# Altium schematic sheet HashUnit4.SchDoc: ANT_Miner_V1.3
size A2; Date: 2013/11/20; DrawnBy: Bitmain Technology; SheetNumber: 9; SheetTotal: 9
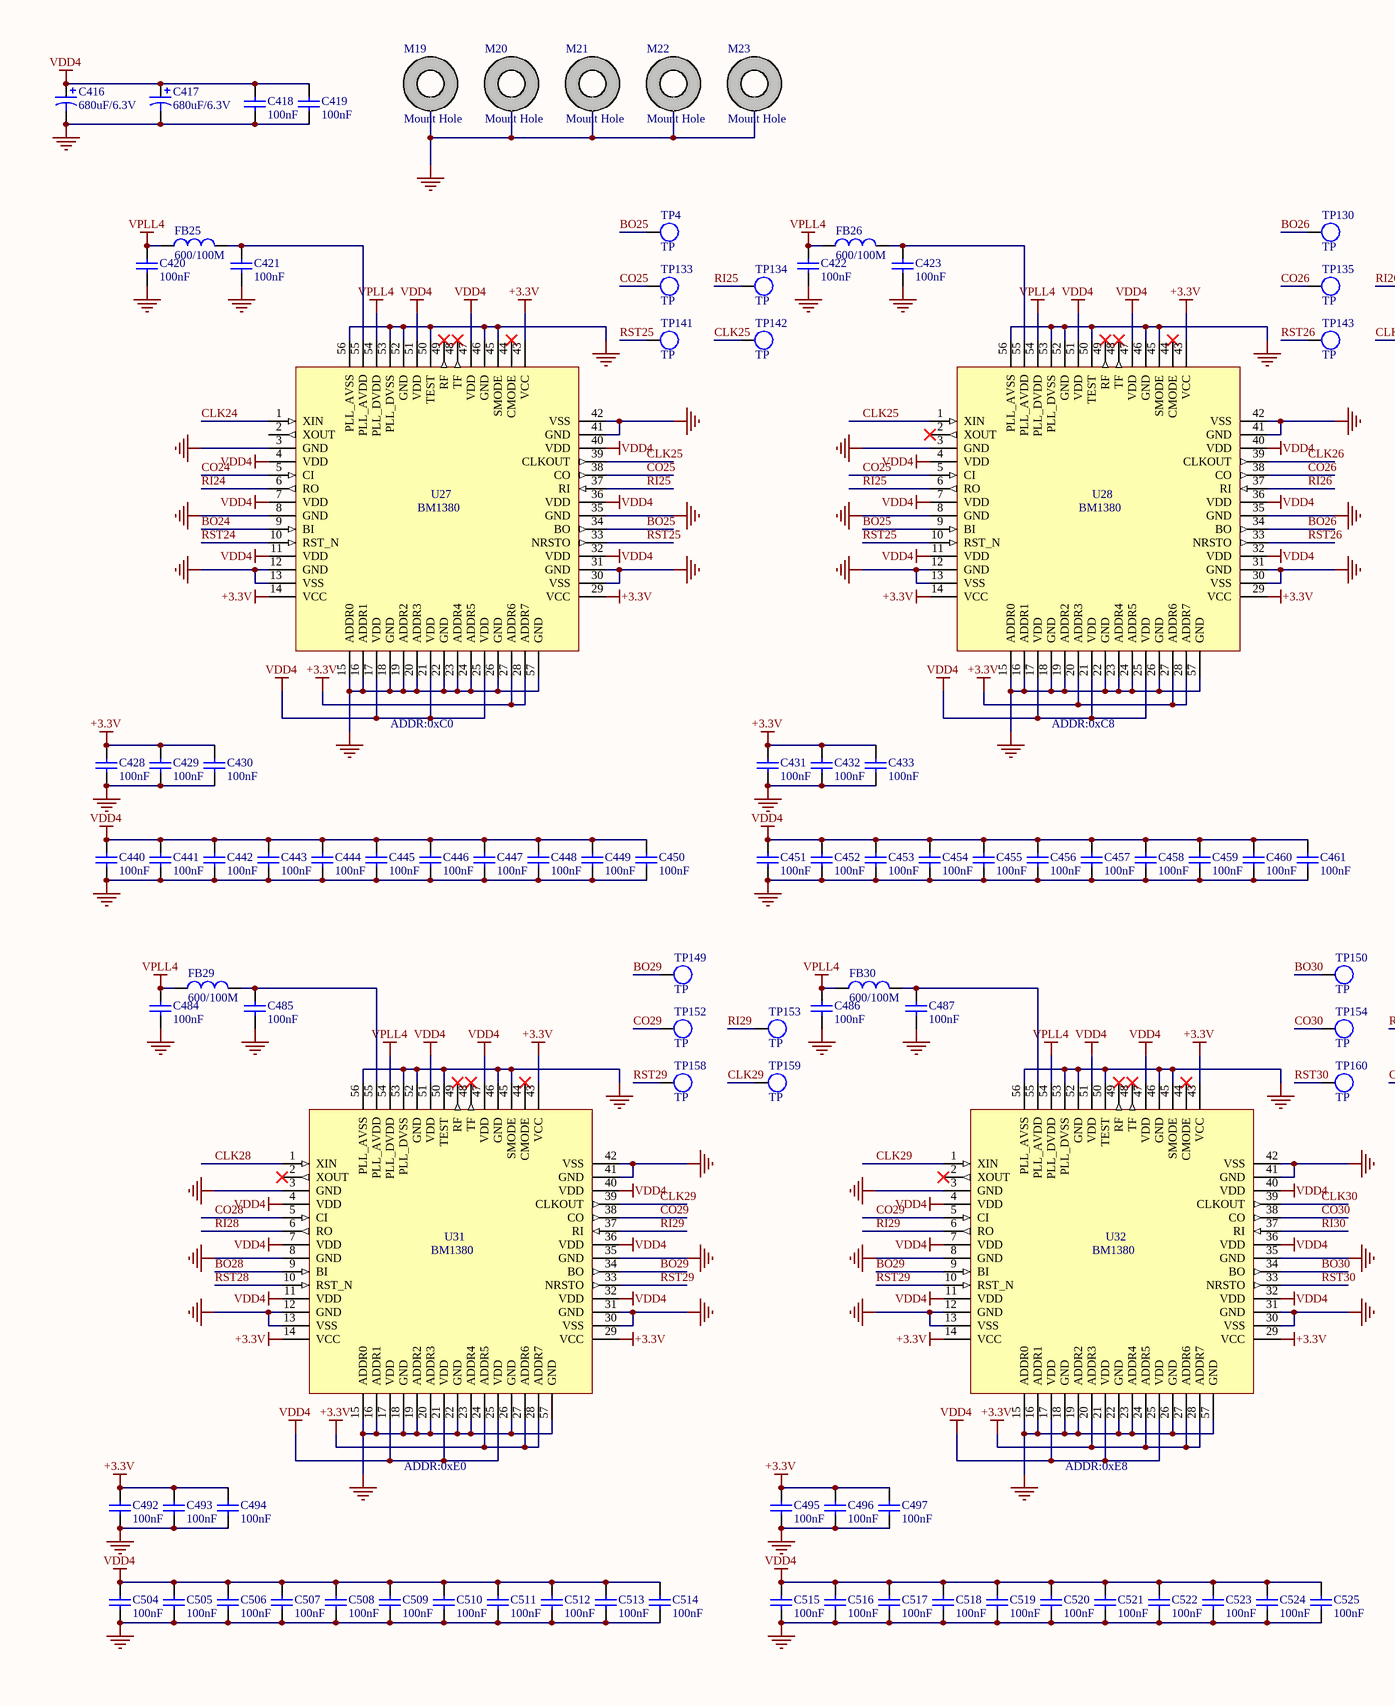
[diagram p0: HashUnit4.SchDoc, left]
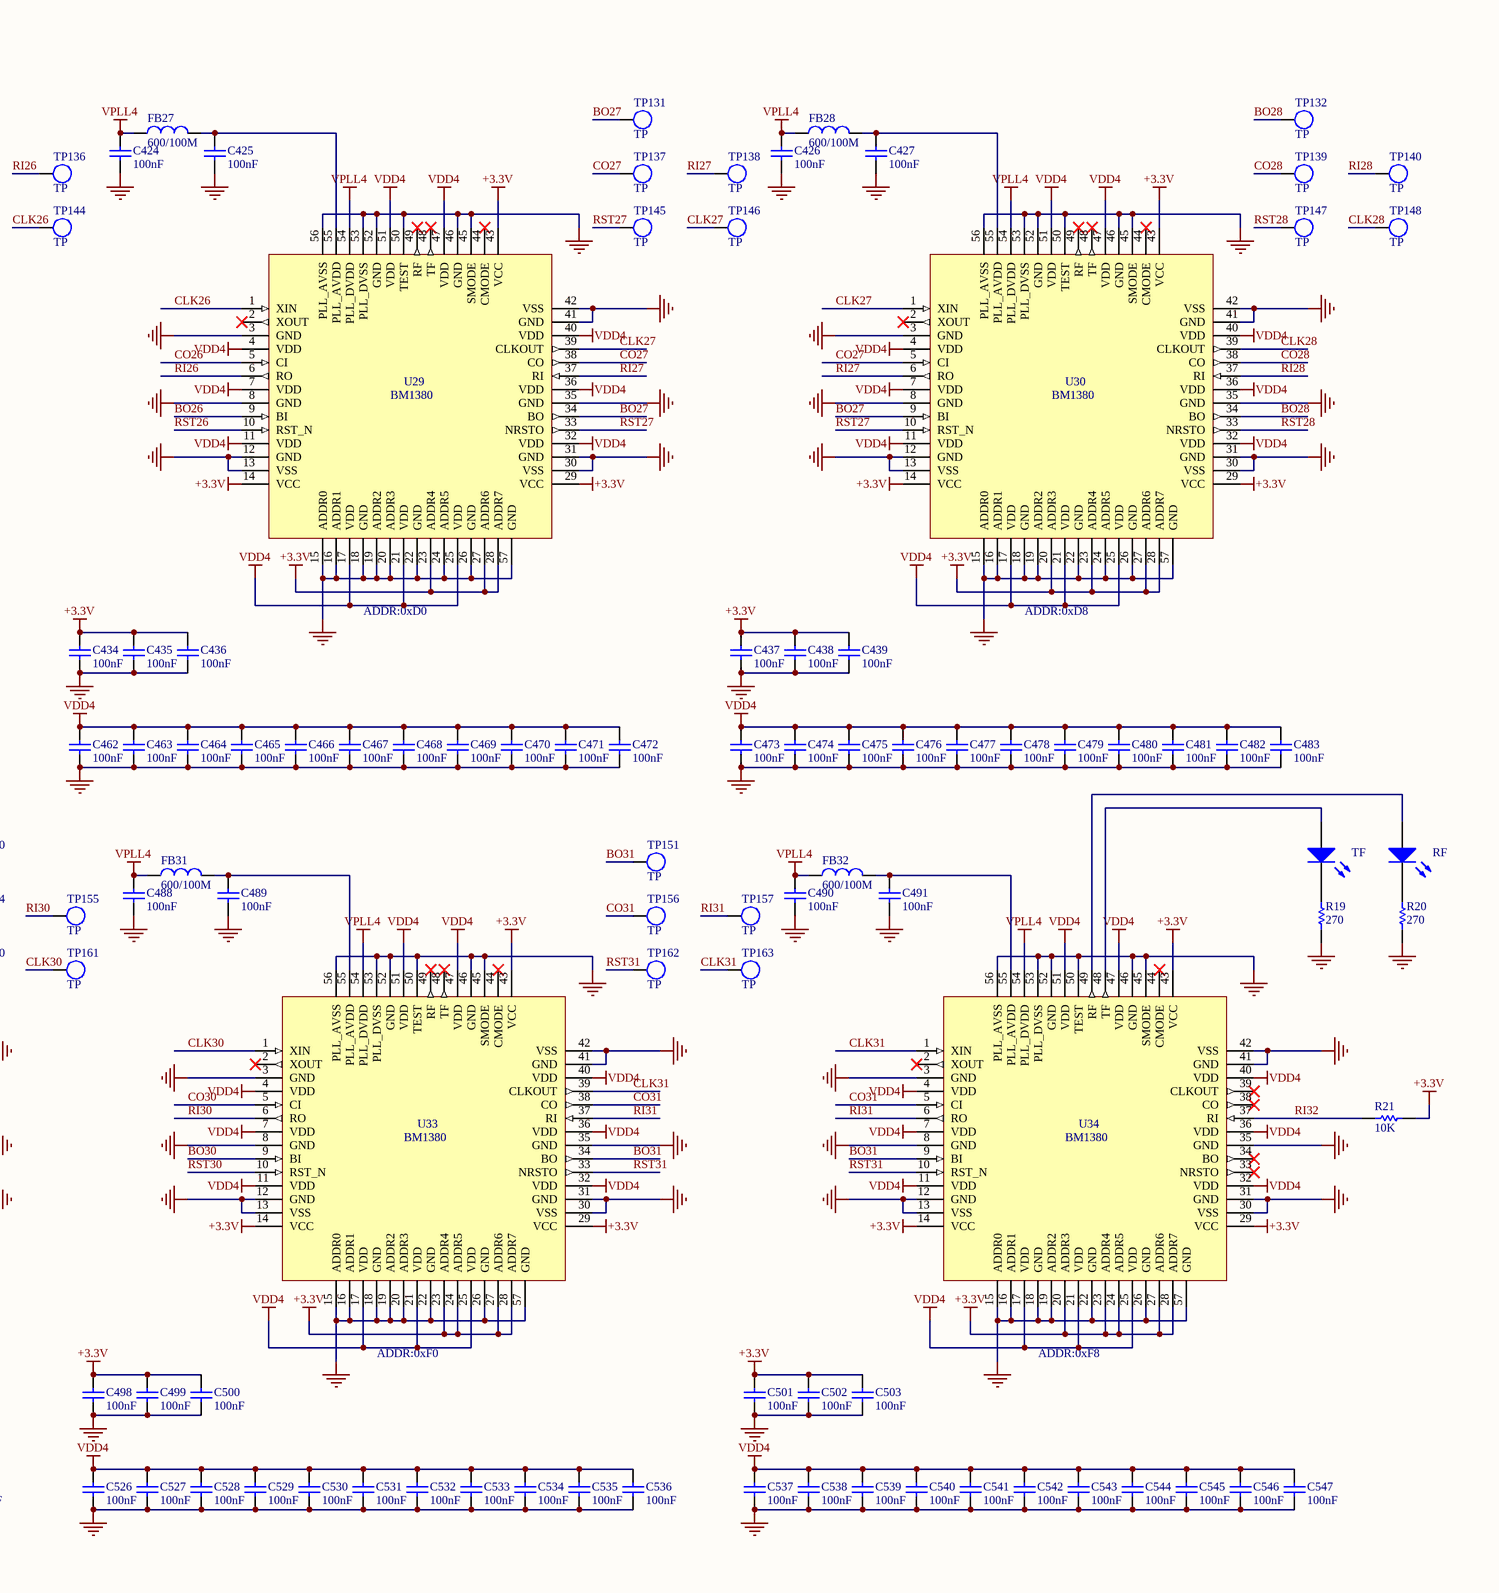
[diagram p1: HashUnit4.SchDoc, right]

## Parts
C416  680uF/6.3V  [D]
C417  680uF/6.3V  [D]
C418  100nF  [CC0603(1608)]
C419  100nF  [CC0603(1608)]
C420  100nF  [CC0603(1608)]
C421  100nF  [CC0603(1608)]
C422  100nF  [CC0603(1608)]
C423  100nF  [CC0603(1608)]
C424  100nF  [CC0603(1608)]
C425  100nF  [CC0603(1608)]
C426  100nF  [CC0603(1608)]
C427  100nF  [CC0603(1608)]
C428  100nF  [CC0603(1608)]
C429  100nF  [CC0603(1608)]
C430  100nF  [CC0603(1608)]
C431  100nF  [CC0603(1608)]
C432  100nF  [CC0603(1608)]
C433  100nF  [CC0603(1608)]
C434  100nF  [CC0603(1608)]
C435  100nF  [CC0603(1608)]
C436  100nF  [CC0603(1608)]
C437  100nF  [CC0603(1608)]
C438  100nF  [CC0603(1608)]
C439  100nF  [CC0603(1608)]
C440  100nF  [CC0603(1608)]
C441  100nF  [CC0603(1608)]
C442  100nF  [CC0603(1608)]
C443  100nF  [CC0603(1608)]
C444  100nF  [CC0603(1608)]
C445  100nF  [CC0603(1608)]
C446  100nF  [CC0603(1608)]
C447  100nF  [CC0603(1608)]
C448  100nF  [CC0603(1608)]
C449  100nF  [CC0603(1608)]
C450  100nF  [CC0603(1608)]
C451  100nF  [CC0603(1608)]
C452  100nF  [CC0603(1608)]
C453  100nF  [CC0603(1608)]
C454  100nF  [CC0603(1608)]
C455  100nF  [CC0603(1608)]
C456  100nF  [CC0603(1608)]
C457  100nF  [CC0603(1608)]
C458  100nF  [CC0603(1608)]
C459  100nF  [CC0603(1608)]
C460  100nF  [CC0603(1608)]
C461  100nF  [CC0603(1608)]
C462  100nF  [CC0603(1608)]
C463  100nF  [CC0603(1608)]
C464  100nF  [CC0603(1608)]
C465  100nF  [CC0603(1608)]
C466  100nF  [CC0603(1608)]
C467  100nF  [CC0603(1608)]
C468  100nF  [CC0603(1608)]
C469  100nF  [CC0603(1608)]
C470  100nF  [CC0603(1608)]
C471  100nF  [CC0603(1608)]
C472  100nF  [CC0603(1608)]
C473  100nF  [CC0603(1608)]
C474  100nF  [CC0603(1608)]
C475  100nF  [CC0603(1608)]
C476  100nF  [CC0603(1608)]
C477  100nF  [CC0603(1608)]
C478  100nF  [CC0603(1608)]
C479  100nF  [CC0603(1608)]
C480  100nF  [CC0603(1608)]
C481  100nF  [CC0603(1608)]
C482  100nF  [CC0603(1608)]
C483  100nF  [CC0603(1608)]
C484  100nF  [CC0603(1608)]
C485  100nF  [CC0603(1608)]
C486  100nF  [CC0603(1608)]
C487  100nF  [CC0603(1608)]
C488  100nF  [CC0603(1608)]
C489  100nF  [CC0603(1608)]
C490  100nF  [CC0603(1608)]
C491  100nF  [CC0603(1608)]
C492  100nF  [CC0603(1608)]
C493  100nF  [CC0603(1608)]
C494  100nF  [CC0603(1608)]
C495  100nF  [CC0603(1608)]
C496  100nF  [CC0603(1608)]
C497  100nF  [CC0603(1608)]
C498  100nF  [CC0603(1608)]
C499  100nF  [CC0603(1608)]
C500  100nF  [CC0603(1608)]
C501  100nF  [CC0603(1608)]
C502  100nF  [CC0603(1608)]
C503  100nF  [CC0603(1608)]
C504  100nF  [CC0603(1608)]
C505  100nF  [CC0603(1608)]
C506  100nF  [CC0603(1608)]
C507  100nF  [CC0603(1608)]
C508  100nF  [CC0603(1608)]
C509  100nF  [CC0603(1608)]
C510  100nF  [CC0603(1608)]
C511  100nF  [CC0603(1608)]
C512  100nF  [CC0603(1608)]
C513  100nF  [CC0603(1608)]
C514  100nF  [CC0603(1608)]
C515  100nF  [CC0603(1608)]
C516  100nF  [CC0603(1608)]
C517  100nF  [CC0603(1608)]
C518  100nF  [CC0603(1608)]
C519  100nF  [CC0603(1608)]
C520  100nF  [CC0603(1608)]
C521  100nF  [CC0603(1608)]
C522  100nF  [CC0603(1608)]
C523  100nF  [CC0603(1608)]
C524  100nF  [CC0603(1608)]
C525  100nF  [CC0603(1608)]
C526  100nF  [CC0603(1608)]
C527  100nF  [CC0603(1608)]
C528  100nF  [CC0603(1608)]
C529  100nF  [CC0603(1608)]
C530  100nF  [CC0603(1608)]
C531  100nF  [CC0603(1608)]
C532  100nF  [CC0603(1608)]
C533  100nF  [CC0603(1608)]
C534  100nF  [CC0603(1608)]
C535  100nF  [CC0603(1608)]
C536  100nF  [CC0603(1608)]
C537  100nF  [CC0603(1608)]
C538  100nF  [CC0603(1608)]
C539  100nF  [CC0603(1608)]
C540  100nF  [CC0603(1608)]
C541  100nF  [CC0603(1608)]
C542  100nF  [CC0603(1608)]
C543  100nF  [CC0603(1608)]
C544  100nF  [CC0603(1608)]
C545  100nF  [CC0603(1608)]
C546  100nF  [CC0603(1608)]
C547  100nF  [CC0603(1608)]
FB25  600/100M  [FB0603(1608)]
FB26  600/100M  [FB0603(1608)]
FB27  600/100M  [FB0603(1608)]
FB28  600/100M  [FB0603(1608)]
FB29  600/100M  [FB0603(1608)]
FB30  600/100M  [FB0603(1608)]
FB31  600/100M  [FB0603(1608)]
FB32  600/100M  [FB0603(1608)]
M19  Mount Hole  [MHOLE2]
M20  Mount Hole  [MHOLE2]
M21  Mount Hole  [MHOLE2]
M22  Mount Hole  [MHOLE2]
M23  Mount Hole  [MHOLE2]
R19  270  [RR0603(1608)]
R20  270  [RR0603(1608)]
R21  10K  [RR0603(1608)]
RF  Green  [LED0603(1608)]  (value not drawn)
TF  Green  [LED0603(1608)]  (value not drawn)
TP4  TP  [TP_SMD]
TP130  TP  [TP_SMD]
TP131  TP  [TP_SMD]
TP132  TP  [TP_SMD]
TP133  TP  [TP_SMD]
TP134  TP  [TP_SMD]
TP135  TP  [TP_SMD]
TP136  TP  [TP_SMD]
TP137  TP  [TP_SMD]
TP138  TP  [TP_SMD]
TP139  TP  [TP_SMD]
TP140  TP  [TP_SMD]
TP141  TP  [TP_SMD]
TP142  TP  [TP_SMD]
TP143  TP  [TP_SMD]
TP144  TP  [TP_SMD]
TP145  TP  [TP_SMD]
TP146  TP  [TP_SMD]
TP147  TP  [TP_SMD]
TP148  TP  [TP_SMD]
TP149  TP  [TP_SMD]
TP150  TP  [TP_SMD]
TP151  TP  [TP_SMD]
TP152  TP  [TP_SMD]
TP153  TP  [TP_SMD]
TP154  TP  [TP_SMD]
TP155  TP  [TP_SMD]
TP156  TP  [TP_SMD]
TP157  TP  [TP_SMD]
TP158  TP  [TP_SMD]
TP159  TP  [TP_SMD]
TP160  TP  [TP_SMD]
TP161  TP  [TP_SMD]
TP162  TP  [TP_SMD]
TP163  TP  [TP_SMD]
U27  BM1380  [QFN56]
U28  BM1380  [QFN56]
U29  BM1380  [QFN56]
U30  BM1380  [QFN56]
U31  BM1380  [QFN56]
U32  BM1380  [QFN56]
U33  BM1380  [QFN56]
U34  BM1380  [QFN56]

## Nets
+3.3V: C428.2 C429.2 C430.2 C431.2 C432.2 C433.2 C434.2 C435.2 C436.2 C437.2 C438.2 C439.2 C492.2 C493.2 C494.2 C495.2 C496.2 C497.2 C498.2 C499.2 C500.2 C501.2 C502.2 C503.2 R21.2 U27.14(VCC) U27.27(ADDR6) U27.28(ADDR7) U27.29(VCC) U27.43(VCC) U28.14(VCC) U28.20(ADDR3) U28.27(ADDR6) U28.28(ADDR7) U28.29(VCC) U28.43(VCC) U29.14(VCC) U29.23(ADDR4) U29.27(ADDR6) U29.28(ADDR7) U29.29(VCC) U29.43(VCC) U30.14(VCC) U30.20(ADDR3) U30.23(ADDR4) U30.27(ADDR6) U30.28(ADDR7) U30.29(VCC) U30.43(VCC) U31.14(VCC) U31.24(ADDR5) U31.27(ADDR6) U31.28(ADDR7) U31.29(VCC) U31.43(VCC) U32.14(VCC) U32.20(ADDR3) U32.24(ADDR5) U32.27(ADDR6) U32.28(ADDR7) U32.29(VCC) U32.43(VCC) U33.14(VCC) U33.23(ADDR4) U33.24(ADDR5) U33.27(ADDR6) U33.28(ADDR7) U33.29(VCC) U33.43(VCC) U34.14(VCC) U34.20(ADDR3) U34.23(ADDR4) U34.24(ADDR5) U34.27(ADDR6) U34.28(ADDR7) U34.29(VCC) U34.43(VCC)
GND: C416.2 C417.2 C418.1 C419.1 C420.2 C421.1 C422.2 C423.1 C424.2 C425.1 C426.2 C427.1 C428.1 C429.1 C430.1 C431.1 C432.1 C433.1 C434.1 C435.1 C436.1 C437.1 C438.1 C439.1 C440.1 C441.1 C442.1 C443.1 C444.1 C445.1 C446.1 C447.1 C448.1 C449.1 C450.1 C451.1 C452.1 C453.1 C454.1 C455.1 C456.1 C457.1 C458.1 C459.1 C460.1 C461.1 C462.1 C463.1 C464.1 C465.1 C466.1 C467.1 C468.1 C469.1 C470.1 C471.1 C472.1 C473.1 C474.1 C475.1 C476.1 C477.1 C478.1 C479.1 C480.1 C481.1 C482.1 C483.1 C484.2 C485.1 C486.2 C487.1 C488.2 C489.1 C490.2 C491.1 C492.1 C493.1 C494.1 C495.1 C496.1 C497.1 C498.1 C499.1 C500.1 C501.1 C502.1 C503.1 C504.1 C505.1 C506.1 C507.1 C508.1 C509.1 C510.1 C511.1 C512.1 C513.1 C514.1 C515.1 C516.1 C517.1 C518.1 C519.1 C520.1 C521.1 C522.1 C523.1 C524.1 C525.1 C526.1 C527.1 C528.1 C529.1 C530.1 C531.1 C532.1 C533.1 C534.1 C535.1 C536.1 C537.1 C538.1 C539.1 C540.1 C541.1 C542.1 C543.1 C544.1 C545.1 C546.1 C547.1 M19.0(PIN) M20.0(PIN) M21.0(PIN) M22.0(PIN) M23.0(PIN) R19.1 R20.1 U27.3(GND) U27.8(GND) U27.12(GND) U27.13(VSS) U27.15(ADDR0) U27.16(ADDR1) U27.18(GND) U27.19(ADDR2) U27.20(ADDR3) U27.22(GND) U27.23(ADDR4) U27.24(ADDR5) U27.26(GND) U27.30(VSS) U27.31(GND) U27.35(GND) U27.41(GND) U27.42(VSS) U27.45(SMODE) U27.46(GND) U27.50(TEST) U27.52(GND) U27.53(PLL_DVSS) U27.56(PLL_AVSS) U27.57(GND) U28.3(GND) U28.8(GND) U28.12(GND) U28.13(VSS) U28.15(ADDR0) U28.16(ADDR1) U28.18(GND) U28.19(ADDR2) U28.22(GND) U28.23(ADDR4) U28.24(ADDR5) U28.26(GND) U28.30(VSS) U28.31(GND) U28.35(GND) U28.41(GND) U28.42(VSS) U28.45(SMODE) U28.46(GND) U28.50(TEST) U28.52(GND) U28.53(PLL_DVSS) U28.56(PLL_AVSS) U28.57(GND) U29.3(GND) U29.8(GND) U29.12(GND) U29.13(VSS) U29.15(ADDR0) U29.16(ADDR1) U29.18(GND) U29.19(ADDR2) U29.20(ADDR3) U29.22(GND) U29.24(ADDR5) U29.26(GND) U29.30(VSS) U29.31(GND) U29.35(GND) U29.41(GND) U29.42(VSS) U29.45(SMODE) U29.46(GND) U29.50(TEST) U29.52(GND) U29.53(PLL_DVSS) U29.56(PLL_AVSS) U29.57(GND) U30.3(GND) U30.8(GND) U30.12(GND) U30.13(VSS) U30.15(ADDR0) U30.16(ADDR1) U30.18(GND) U30.19(ADDR2) U30.22(GND) U30.24(ADDR5) U30.26(GND) U30.30(VSS) U30.31(GND) U30.35(GND) U30.41(GND) U30.42(VSS) U30.45(SMODE) U30.46(GND) U30.50(TEST) U30.52(GND) U30.53(PLL_DVSS) U30.56(PLL_AVSS) U30.57(GND) U31.3(GND) U31.8(GND) U31.12(GND) U31.13(VSS) U31.15(ADDR0) U31.16(ADDR1) U31.18(GND) U31.19(ADDR2) U31.20(ADDR3) U31.22(GND) U31.23(ADDR4) U31.26(GND) U31.30(VSS) U31.31(GND) U31.35(GND) U31.41(GND) U31.42(VSS) U31.45(SMODE) U31.46(GND) U31.50(TEST) U31.52(GND) U31.53(PLL_DVSS) U31.56(PLL_AVSS) U31.57(GND) U32.3(GND) U32.8(GND) U32.12(GND) U32.13(VSS) U32.15(ADDR0) U32.16(ADDR1) U32.18(GND) U32.19(ADDR2) U32.22(GND) U32.23(ADDR4) U32.26(GND) U32.30(VSS) U32.31(GND) U32.35(GND) U32.41(GND) U32.42(VSS) U32.45(SMODE) U32.46(GND) U32.50(TEST) U32.52(GND) U32.53(PLL_DVSS) U32.56(PLL_AVSS) U32.57(GND) U33.3(GND) U33.8(GND) U33.12(GND) U33.13(VSS) U33.15(ADDR0) U33.16(ADDR1) U33.18(GND) U33.19(ADDR2) U33.20(ADDR3) U33.22(GND) U33.26(GND) U33.30(VSS) U33.31(GND) U33.35(GND) U33.41(GND) U33.42(VSS) U33.45(SMODE) U33.46(GND) U33.50(TEST) U33.52(GND) U33.53(PLL_DVSS) U33.56(PLL_AVSS) U33.57(GND) U34.3(GND) U34.8(GND) U34.12(GND) U34.13(VSS) U34.15(ADDR0) U34.16(ADDR1) U34.18(GND) U34.19(ADDR2) U34.22(GND) U34.26(GND) U34.30(VSS) U34.31(GND) U34.35(GND) U34.41(GND) U34.42(VSS) U34.45(SMODE) U34.46(GND) U34.50(TEST) U34.52(GND) U34.53(PLL_DVSS) U34.56(PLL_AVSS) U34.57(GND)
VDD4: C416.1 C417.1 C418.2 C419.2 C440.2 C441.2 C442.2 C443.2 C444.2 C445.2 C446.2 C447.2 C448.2 C449.2 C450.2 C451.2 C452.2 C453.2 C454.2 C455.2 C456.2 C457.2 C458.2 C459.2 C460.2 C461.2 C462.2 C463.2 C464.2 C465.2 C466.2 C467.2 C468.2 C469.2 C470.2 C471.2 C472.2 C473.2 C474.2 C475.2 C476.2 C477.2 C478.2 C479.2 C480.2 C481.2 C482.2 C483.2 C504.2 C505.2 C506.2 C507.2 C508.2 C509.2 C510.2 C511.2 C512.2 C513.2 C514.2 C515.2 C516.2 C517.2 C518.2 C519.2 C520.2 C521.2 C522.2 C523.2 C524.2 C525.2 C526.2 C527.2 C528.2 C529.2 C530.2 C531.2 C532.2 C533.2 C534.2 C535.2 C536.2 C537.2 C538.2 C539.2 C540.2 C541.2 C542.2 C543.2 C544.2 C545.2 C546.2 C547.2 U27.4(VDD) U27.7(VDD) U27.11(VDD) U27.17(VDD) U27.21(VDD) U27.25(VDD) U27.32(VDD) U27.36(VDD) U27.40(VDD) U27.47(VDD) U27.51(VDD) U28.4(VDD) U28.7(VDD) U28.11(VDD) U28.17(VDD) U28.21(VDD) U28.25(VDD) U28.32(VDD) U28.36(VDD) U28.40(VDD) U28.47(VDD) U28.51(VDD) U29.4(VDD) U29.7(VDD) U29.11(VDD) U29.17(VDD) U29.21(VDD) U29.25(VDD) U29.32(VDD) U29.36(VDD) U29.40(VDD) U29.47(VDD) U29.51(VDD) U30.4(VDD) U30.7(VDD) U30.11(VDD) U30.17(VDD) U30.21(VDD) U30.25(VDD) U30.32(VDD) U30.36(VDD) U30.40(VDD) U30.47(VDD) U30.51(VDD) U31.4(VDD) U31.7(VDD) U31.11(VDD) U31.17(VDD) U31.21(VDD) U31.25(VDD) U31.32(VDD) U31.36(VDD) U31.40(VDD) U31.47(VDD) U31.51(VDD) U32.4(VDD) U32.7(VDD) U32.11(VDD) U32.17(VDD) U32.21(VDD) U32.25(VDD) U32.32(VDD) U32.36(VDD) U32.40(VDD) U32.47(VDD) U32.51(VDD) U33.4(VDD) U33.7(VDD) U33.11(VDD) U33.17(VDD) U33.21(VDD) U33.25(VDD) U33.32(VDD) U33.36(VDD) U33.40(VDD) U33.47(VDD) U33.51(VDD) U34.4(VDD) U34.7(VDD) U34.11(VDD) U34.17(VDD) U34.21(VDD) U34.25(VDD) U34.32(VDD) U34.36(VDD) U34.40(VDD) U34.47(VDD) U34.51(VDD)
VPLL4: C420.1 C422.1 C424.1 C426.1 C484.1 C486.1 C488.1 C490.1 FB25.2 FB26.2 FB27.2 FB28.2 FB29.2 FB30.2 FB31.2 FB32.2 U27.54(PLL_DVDD) U28.54(PLL_DVDD) U29.54(PLL_DVDD) U30.54(PLL_DVDD) U31.54(PLL_DVDD) U32.54(PLL_DVDD) U33.54(PLL_DVDD) U34.54(PLL_DVDD)
BO24: U27.9(BI)
BO25: TP4.1 U27.34(BO) U28.9(BI)
BO26: TP130.1 U28.34(BO) U29.9(BI)
BO27: TP131.1 U29.34(BO) U30.9(BI)
BO28: TP132.1 U30.34(BO) U31.9(BI)
BO29: TP149.1 U31.34(BO) U32.9(BI)
BO30: TP150.1 U32.34(BO) U33.9(BI)
BO31: TP151.1 U33.34(BO) U34.9(BI)
CLK24: U27.1(XIN)
CLK25: TP142.1 U27.39(CLKOUT) U28.1(XIN)
CLK26: TP144.1 U28.39(CLKOUT) U29.1(XIN)
CLK27: TP146.1 U29.39(CLKOUT) U30.1(XIN)
CLK28: TP148.1 U30.39(CLKOUT) U31.1(XIN)
CLK29: TP159.1 U31.39(CLKOUT) U32.1(XIN)
CLK30: TP161.1 U32.39(CLKOUT) U33.1(XIN)
CLK31: TP163.1 U33.39(CLKOUT) U34.1(XIN)
CO24: U27.5(CI)
CO25: TP133.1 U27.38(CO) U28.5(CI)
CO26: TP135.1 U28.38(CO) U29.5(CI)
CO27: TP137.1 U29.38(CO) U30.5(CI)
CO28: TP139.1 U30.38(CO) U31.5(CI)
CO29: TP152.1 U31.38(CO) U32.5(CI)
CO30: TP154.1 U32.38(CO) U33.5(CI)
CO31: TP156.1 U33.38(CO) U34.5(CI)
RI24: U27.6(RO)
RI25: TP134.1 U27.37(RI) U28.6(RO)
RI26: TP136.1 U28.37(RI) U29.6(RO)
RI27: TP138.1 U29.37(RI) U30.6(RO)
RI28: TP140.1 U30.37(RI) U31.6(RO)
RI29: TP153.1 U31.37(RI) U32.6(RO)
RI30: TP155.1 U32.37(RI) U33.6(RO)
RI31: TP157.1 U33.37(RI) U34.6(RO)
RI32: R21.1 U34.37(RI)
RST24: U27.10(RST_N)
RST25: TP141.1 U27.33(NRSTO) U28.10(RST_N)
RST26: TP143.1 U28.33(NRSTO) U29.10(RST_N)
RST27: TP145.1 U29.33(NRSTO) U30.10(RST_N)
RST28: TP147.1 U30.33(NRSTO) U31.10(RST_N)
RST29: TP158.1 U31.33(NRSTO) U32.10(RST_N)
RST30: TP160.1 U32.33(NRSTO) U33.10(RST_N)
RST31: TP162.1 U33.33(NRSTO) U34.10(RST_N)
NetC421_2: C421.2 FB25.1 U27.55(PLL_AVDD)
NetC423_2: C423.2 FB26.1 U28.55(PLL_AVDD)
NetC425_2: C425.2 FB27.1 U29.55(PLL_AVDD)
NetC427_2: C427.2 FB28.1 U30.55(PLL_AVDD)
NetC485_2: C485.2 FB29.1 U31.55(PLL_AVDD)
NetC487_2: C487.2 FB30.1 U32.55(PLL_AVDD)
NetC489_2: C489.2 FB31.1 U33.55(PLL_AVDD)
NetC491_2: C491.2 FB32.1 U34.55(PLL_AVDD)
NetR19_2: R19.2 TF.2(K)
NetR20_2: R20.2 RF.2(K)
NetRF_1: RF.1(A) U34.49(RF)
NetTF_1: TF.1(A) U34.48(TF)

Not connected (* = marked no-connect by the designer): U27 2(XOUT) 44(CMODE)* 48(TF)* 49(RF)*; U28 2(XOUT)* 44(CMODE)* 48(TF)* 49(RF)*; U29 2(XOUT)* 44(CMODE)* 48(TF)* 49(RF)*; U30 2(XOUT)* 44(CMODE)* 48(TF)* 49(RF)*; U31 2(XOUT)* 44(CMODE)* 48(TF)* 49(RF)*; U32 2(XOUT)* 44(CMODE)* 48(TF)* 49(RF)*; U33 2(XOUT)* 44(CMODE)* 48(TF)* 49(RF)*; U34 2(XOUT)* 33(NRSTO)* 34(BO)* 38(CO)* 39(CLKOUT)* 44(CMODE)*

## Notes on the sheet
- ADDR:0xC0
- ADDR:0xC8
- ADDR:0xD0
- ADDR:0xD8
- ADDR:0xE0
- ADDR:0xE8
- ADDR:0xF0
- ADDR:0xF8

## Library data of the parts
C416 C417 = T492C: Solid Tantalum Chip Capacitor, T492 Series - CWR11 Style Per Mil-PRF-55365/8; Published: 17-Jul-2002; LatestRevisionDate: 19-Mar-2004; LatestRevisionNote: Silkscreen dimensions re-sized.; DatasheetDocument: Mar-2001; PackageDocument: Mar-2001; PackageReference: C; Publisher: Altium Limited; Code_JEITA: 6032-28; ComponentLink1Description: Manufacturer Link; ComponentLink1URL: http://www.kemet.com/; ComponentLink2Description: Datasheet; ComponentLink2URL: http://www.kemet.com/kemet/web/homepage/kechome.nsf/vapubfilesname/F3102TA.pdf/$file/F3102TA.pdf; Value: 680uF/6.3V
C418 C419 = Cap Semi: Capacitor (Semiconductor SIM Model); Published: 8-Jun-2000; LatestRevisionDate: 29-May-2009; LatestRevisionNote: IPC-7351 Footprint Added.; PackageReference: C1206; Publisher: Altium Limited; PackageDescription: Chip Capacitor; Value: 100nF
C420-C547 = Cap: Capacitor; Published: 8-Jun-2000; LatestRevisionDate: 17-Jul-2002; LatestRevisionNote: Re-released for DXP Platform.; PackageReference: RAD-0.3; Publisher: Altium Limited; PackageDescription: Radial Cap, Thru-Hole; 2 Leads; 0.3 in Pin Spacing; Value: 100nF
FB25-FB32 = FB: Inductor; Code_IEC: 1005; Published: 8-Jun-2000; LatestRevisionDate: 29-May-2009; LatestRevisionNote: IPC-7351 Footprint Added.; PackageReference: 0402-A; Publisher: Altium Limited; PackageDescription: Chip Inductor; Code_JEITA: 0402; Value: 600/100M
M19-M23 = M_Hole
R19-R21 = Res1: Resistor
  R19 R20: Value: 270
  R21: Published: 8-Jun-2000; LatestRevisionDate: 17-Jul-2002; LatestRevisionNote: Re-released for DXP Platform.; PackageReference: AXIAL-0.3; Publisher: Altium Limited; PackageDescription: Axial Device, Thru-Hole; 2 Leads; 0.3 in Pin Spacing; Value: 10K
RF TF = LED0: Typical INFRARED GaAs LED; Published: 8-Jun-2000; LatestRevisionDate: 08-Jul-2005; LatestRevisionNote: Mech Layer 1 removed.; PackageReference: LED-0; Publisher: Altium Limited; PackageDescription: LED; 2 Leads; value: Green
TP4 TP130-TP163 = TP: Test Point; Value: TP